# Altium schematic sheet 15.RK3588_VCCIO5.SchDoc
size A3; SheetNumber: 15; SheetTotal: 21
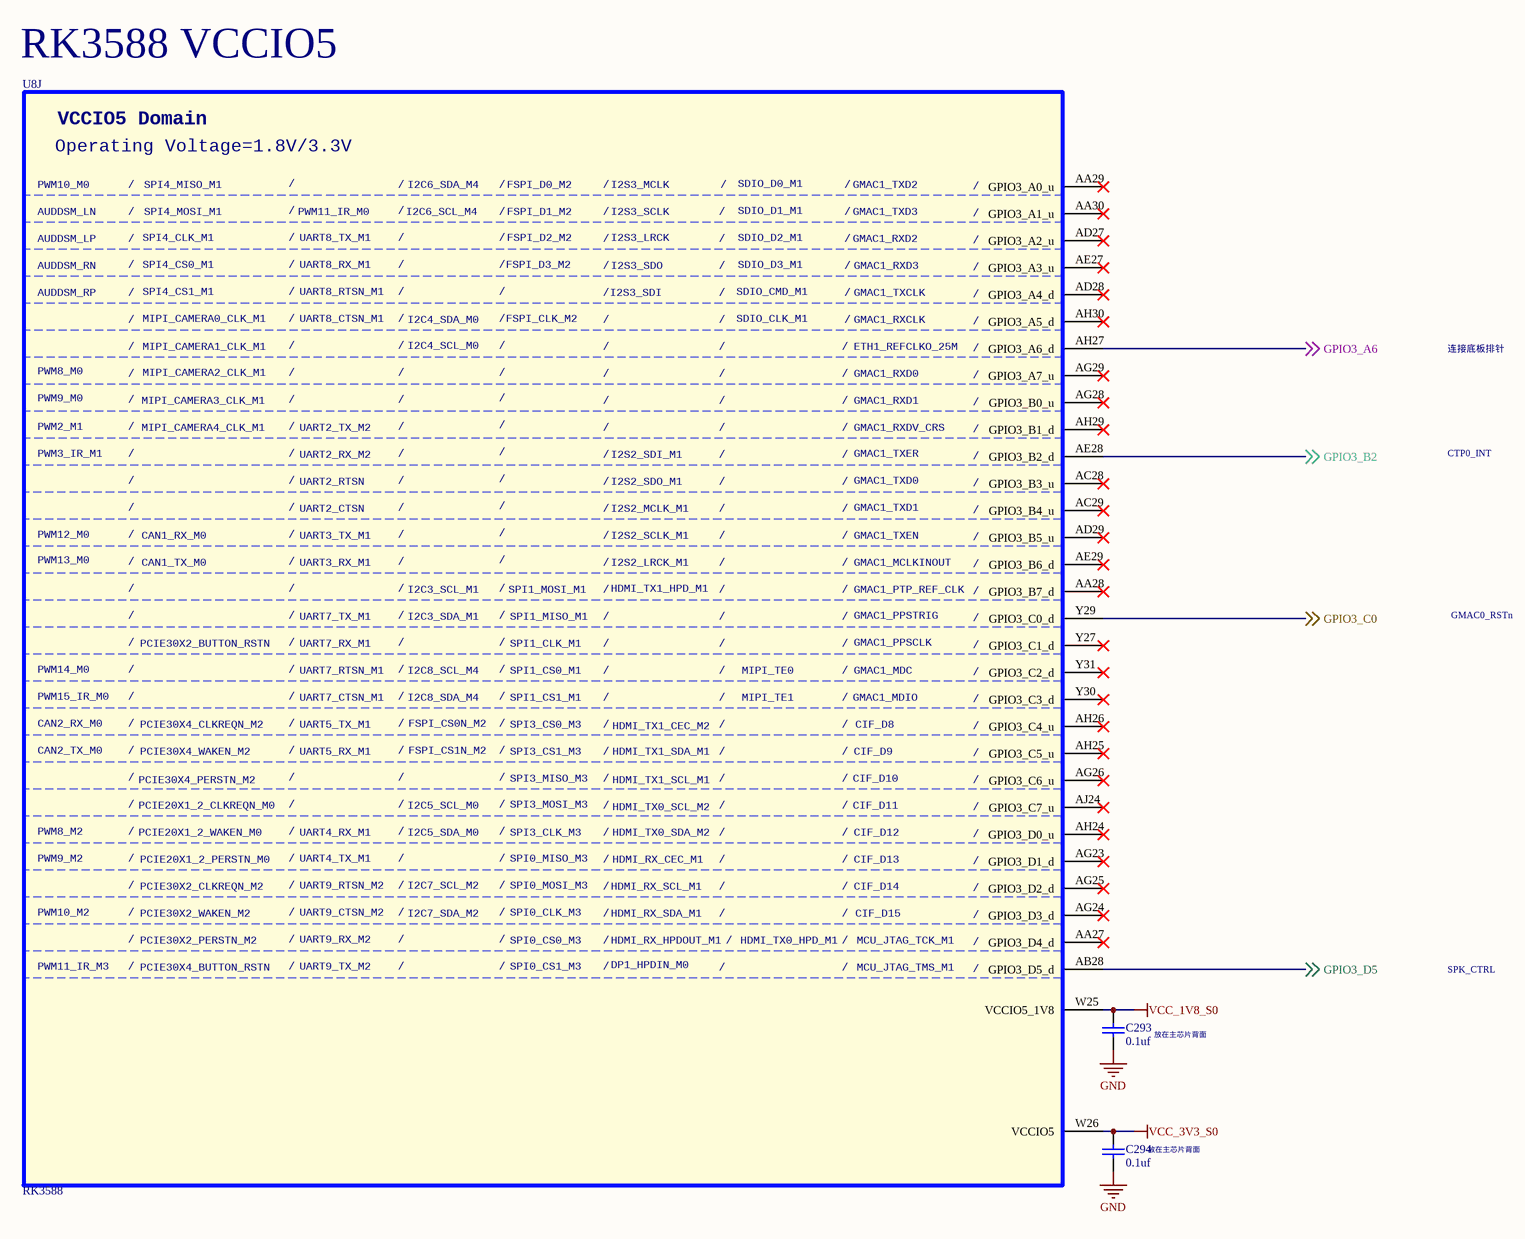
[diagram p0: 15.RK3588_VCCIO5.SchDoc]

## Parts
C293  0.1uf  [C0201_L]
C294  0.1uf  [C0201_L]
U8  RK3588  [BGA1088_23R00X23R00X2R00]  (part J of 26)

## Nets
GND: C293.1 C294.1
VCC_1V8_S0: C293.2 U8.W25(VCCIO5_1V8)
VCC_3V3_S0: C294.2 U8.W26(VCCIO5)
GPIO3_A6: U8.AH27(GPIO3_A6_d) ; off-sheet GPIO3_A6
GPIO3_B2: U8.AE28(GPIO3_B2_d) ; off-sheet GPIO3_B2
GPIO3_C0: U8.Y29(GPIO3_C0_d) ; off-sheet GPIO3_C0
GPIO3_D5: U8.AB28(GPIO3_D5_d) ; off-sheet GPIO3_D5

Not connected (* = marked no-connect by the designer): U8 AA27(GPIO3_D4_d)* AA28(GPIO3_B7_d)* AA29(GPIO3_A0_u)* AA30(GPIO3_A1_u)* AC28(GPIO3_B3_u)* AC29(GPIO3_B4_u)* AD27(GPIO3_A2_u)* AD28(GPIO3_A4_d)* AD29(GPIO3_B5_u)* AE27(GPIO3_A3_u)* AE29(GPIO3_B6_d)* AG23(GPIO3_D1_d)* AG24(GPIO3_D3_d)* AG25(GPIO3_D2_d)* AG26(GPIO3_C6_u)* AG28(GPIO3_B0_u)* AG29(GPIO3_A7_u)* AH24(GPIO3_D0_u)* AH25(GPIO3_C5_u)* AH26(GPIO3_C4_u)* AH29(GPIO3_B1_d)* AH30(GPIO3_A5_d)* AJ24(GPIO3_C7_u)* Y27(GPIO3_C1_d)* Y30(GPIO3_C3_d)* Y31(GPIO3_C2_d)*

## Notes on the sheet
- RK3588 VCCIO5
- 连接底板排针
- CTP0_INT
- GMAC0_RSTn
- SPK_CTRL
- (near C293) 放在主芯片背面
- (near C294) 放在主芯片背面
- (in symbol SOC_RK3588, part J) VCCIO5 Domain; Operating Voltage=1.8V/3.3V; PWM10_M0; /; SPI4_MISO_M1; I2C6_SDA_M4; FSPI_D0_M2; I2S3_MCLK; SDIO_D0_M1; GMAC1_TXD2; AUDDSM_LN; SPI4_MOSI_M1; PWM11_IR_M0; I2C6_SCL_M4; FSPI_D1_M2; I2S3_SCLK; SDIO_D1_M1; GMAC1_TXD3; AUDDSM_LP; SPI4_CLK_M1; UART8_TX_M1; FSPI_D2_M2; I2S3_LRCK; SDIO_D2_M1; GMAC1_RXD2; AUDDSM_RN; SPI4_CS0_M1; UART8_RX_M1; FSPI_D3_M2; I2S3_SDO; SDIO_D3_M1; GMAC1_RXD3; AUDDSM_RP; SPI4_CS1_M1; UART8_RTSN_M1; I2S3_SDI; SDIO_CMD_M1; GMAC1_TXCLK; MIPI_CAMERA0_CLK_M1; UART8_CTSN_M1; I2C4_SDA_M0; FSPI_CLK_M2; SDIO_CLK_M1; GMAC1_RXCLK; MIPI_CAMERA1_CLK_M1; I2C4_SCL_M0; ETH1_REFCLKO_25M; PWM8_M0; MIPI_CAMERA2_CLK_M1; GMAC1_RXD0; PWM9_M0; MIPI_CAMERA3_CLK_M1; GMAC1_RXD1; PWM2_M1; MIPI_CAMERA4_CLK_M1; UART2_TX_M2; GMAC1_RXDV_CRS; PWM3_IR_M1; UART2_RX_M2; I2S2_SDI_M1; GMAC1_TXER; UART2_RTSN; I2S2_SDO_M1; GMAC1_TXD0; UART2_CTSN; I2S2_MCLK_M1; GMAC1_TXD1; PWM12_M0; CAN1_RX_M0; UART3_TX_M1; I2S2_SCLK_M1; GMAC1_TXEN; PWM13_M0; CAN1_TX_M0; UART3_RX_M1; I2S2_LRCK_M1; GMAC1_MCLKINOUT; I2C3_SCL_M1; SPI1_MOSI_M1; HDMI_TX1_HPD_M1; GMAC1_PTP_REF_CLK; UART7_TX_M1; I2C3_SDA_M1; SPI1_MISO_M1; GMAC1_PPSTRIG; PCIE30X2_BUTTON_RSTN; UART7_RX_M1; SPI1_CLK_M1; GMAC1_PPSCLK; PWM14_M0; UART7_RTSN_M1; I2C8_SCL_M4; SPI1_CS0_M1; MIPI_TE0; GMAC1_MDC; PWM15_IR_M0; UART7_CTSN_M1; I2C8_SDA_M4; SPI1_CS1_M1; MIPI_TE1; GMAC1_MDIO; CAN2_RX_M0; PCIE30X4_CLKREQN_M2; UART5_TX_M1; FSPI_CS0N_M2; SPI3_CS0_M3; HDMI_TX1_CEC_M2; CIF_D8; CAN2_TX_M0; PCIE30X4_WAKEN_M2; UART5_RX_M1; FSPI_CS1N_M2; SPI3_CS1_M3; HDMI_TX1_SDA_M1; CIF_D9; PCIE30X4_PERSTN_M2; SPI3_MISO_M3; HDMI_TX1_SCL_M1; CIF_D10; PCIE20X1_2_CLKREQN_M0; I2C5_SCL_M0; SPI3_MOSI_M3; HDMI_TX0_SCL_M2; CIF_D11; PWM8_M2; PCIE20X1_2_WAKEN_M0; UART4_RX_M1; I2C5_SDA_M0; SPI3_CLK_M3; HDMI_TX0_SDA_M2; CIF_D12; PWM9_M2; PCIE20X1_2_PERSTN_M0; UART4_TX_M1; SPI0_MISO_M3; HDMI_RX_CEC_M1; CIF_D13; PCIE30X2_CLKREQN_M2; UART9_RTSN_M2; I2C7_SCL_M2; SPI0_MOSI_M3; HDMI_RX_SCL_M1; CIF_D14; PWM10_M2; PCIE30X2_WAKEN_M2; UART9_CTSN_M2; I2C7_SDA_M2; SPI0_CLK_M3; HDMI_RX_SDA_M1; CIF_D15; PCIE30X2_PERSTN_M2; UART9_RX_M2; SPI0_CS0_M3; HDMI_RX_HPDOUT_M1; HDMI_TX0_HPD_M1; MCU_JTAG_TCK_M1; DP1_HPDIN_M0; PWM11_IR_M3; PCIE30X4_BUTTON_RSTN; UART9_TX_M2; SPI0_CS1_M3; MCU_JTAG_TMS_M1

## Library data of the parts
C293 C294 = C: 贴片电容/MLCC电容
U8 = SOC_RK3588: ROCKCHIP SOC